# EAGLE design schematic (EAGLE 8.5.0)
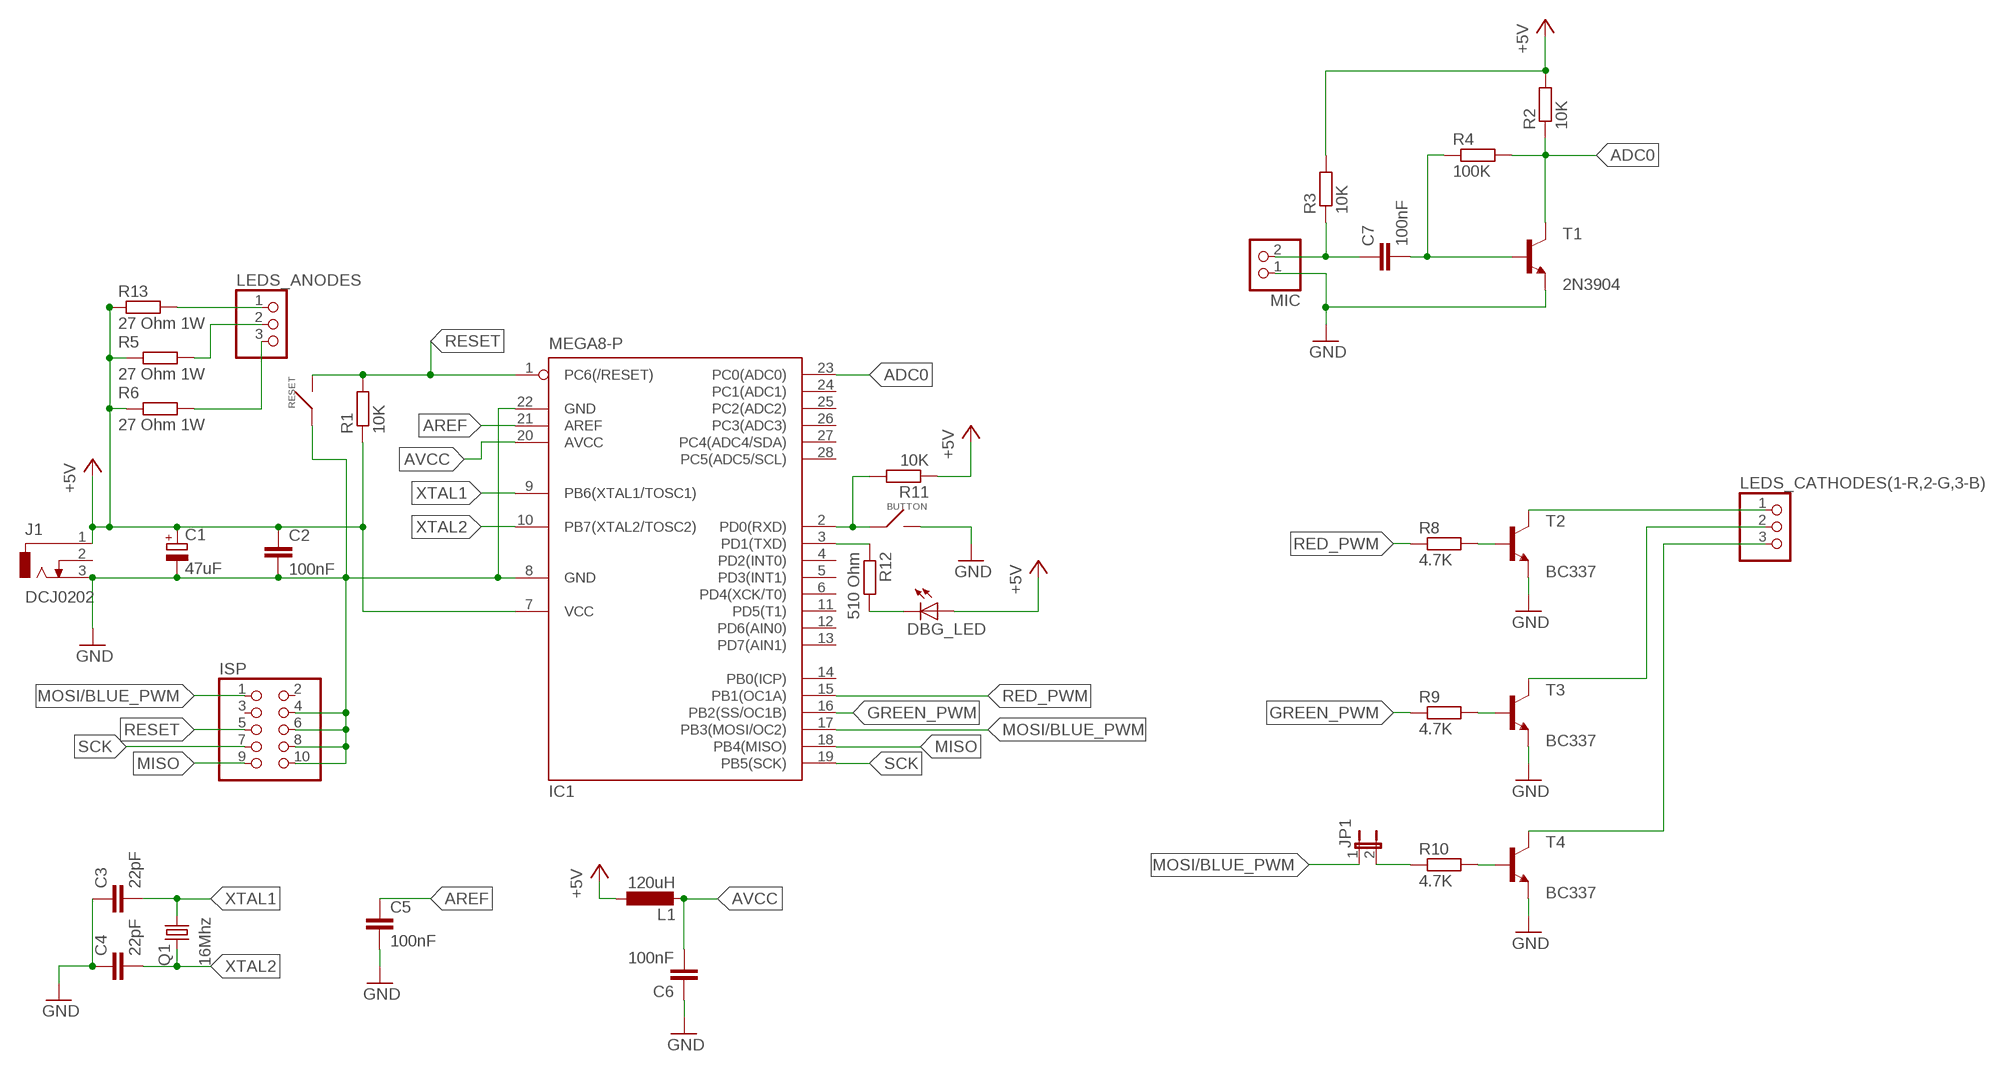
[diagram p0: schematic, sheet 1]

## Parts
BUTTON  TS1102  [TL1105]
C1  47uF  CPOL-EUE2-4  [E2-4]
C2  100nF  C-EUC1206  [C1206]
C3  22pF  C-EU050-024X044  [C050-024X044]
C4  22pF  C-EU050-024X044  [C050-024X044]
C5  100nF  C-EUC1206  [C1206]
C6  100nF  C-EUC1206  [C1206]
C7  100nF  C-EUC1206  [C1206]
DBG_LED  LED3MM  [LED3MM]
IC1  MEGA8-P  [DIL28-3]
ISP  PINHD-2X5  [2X05]
J1  DCJ0202  [DCJ0202]
JP1  JP1E  [JP1]
L1  120uH  L-EU2200-15.24  [2200-15.24]
LEDS_ANODES  PINHD-1X3  [1X03]
LEDS_CATHODES(1-R,2-G,3-B)  PINHD-1X3  [1X03]
MIC  PINHD-1X2  [1X02]
Q1  16Mhz  CRYSTALHC49S  [HC49/S]
R1  10K  R-EU_M1206  [M1206]
R2  10K  R-EU_M1206  [M1206]
R3  10K  R-EU_M1206  [M1206]
R4  100K  R-EU_M0805  [M0805]
R5  27 Ohm 1W  R-EU_0207/12  [0207/12]
R6  27 Ohm 1W  R-EU_0207/12  [0207/12]
R8  4.7K  R-EU_M0805  [M0805]
R9  4.7K  R-EU_M0805  [M0805]
R10  4.7K  R-EU_M0805  [M0805]
R11  10K  R-EU_M1206  [M1206]
R12  510 Ohm  R-EU_M1206  [M1206]
R13  27 Ohm 1W  R-EU_0207/12  [0207/12]
RESET  TS1102  [TL1105]
T1  2N3904  [TO92]
T2  BC337  [TO92]
T3  BC337  [TO92]
T4  BC337  [TO92]

## Nets
+5V: C1.+ C2.1 DBG_LED.A IC1.7(VCC) J1.1 L1.1 R1.1 R2.2 R3.2 R5.1 R6.1 R11.1 R13.1
ADC0: IC1.23(PC0(ADC0)) R2.1 R4.2 T1.1(C)
AREF: C5.1 IC1.21(AREF)
AVCC: C6.2 IC1.20(AVCC) L1.2
GND: BUTTON.2 C1.- C2.2 C3.1 C4.1 C5.2 C6.1 IC1.8(GND) IC1.22(GND) ISP.4 ISP.6 ISP.8 ISP.10 J1.3 MIC.1 RESET.1 T1.3(E) T2.1(E) T3.1(E) T4.1(E)
GREEN_PWM: IC1.16(PB2(SS/OC1B)) R9.1
MISO: IC1.18(PB4(MISO)) ISP.9
MOSI/BLUE_PWM: IC1.17(PB3(MOSI/OC2)) ISP.1 JP1.1
N$1: C7.1 MIC.2 R3.1
N$2: C7.2 R4.1 T1.2(B)
N$3: LEDS_CATHODES(1-R,2-G,3-B).1 T2.3(C)
N$4: LEDS_ANODES.1 R13.2
N$5: LEDS_ANODES.2 R5.2
N$6: LEDS_ANODES.3 R6.2
N$7: LEDS_CATHODES(1-R,2-G,3-B).2 T3.3(C)
N$8: LEDS_CATHODES(1-R,2-G,3-B).3 T4.3(C)
N$9: R8.2 T2.2(B)
N$10: R9.2 T3.2(B)
N$11: R10.2 T4.2(B)
N$12: JP1.2 R10.1
N$13: BUTTON.1 IC1.2(PD0(RXD)) R11.2
N$14: IC1.3(PD1(TXD)) R12.1
N$15: DBG_LED.K(C) R12.2
RED_PWM: IC1.15(PB1(OC1A)) R8.1
RESET: IC1.1(PC6(/RESET)) ISP.5 R1.2 RESET.2
SCK: IC1.19(PB5(SCK)) ISP.7
XTAL1: C3.2 IC1.9(PB6(XTAL1/TOSC1)) Q1.2
XTAL2: C4.2 IC1.10(PB7(XTAL2/TOSC2)) Q1.1
Unconnected: IC1.4(PD2(INT0)) IC1.5(PD3(INT1)) IC1.6(PD4(XCK/T0)) IC1.11(PD5(T1)) IC1.12(PD6(AIN0)) IC1.13(PD7(AIN1)) IC1.14(PB0(ICP)) IC1.24(PC1(ADC1)) IC1.25(PC2(ADC2)) IC1.26(PC3(ADC3)) IC1.27(PC4(ADC4/SDA)) IC1.28(PC5(ADC5/SCL)) ISP.2 ISP.3 J1.2

## Library data of the parts
BUTTON RESET = untitled:TS1102
C1 = rcl:CPOL-EU: POLARIZED CAPACITOR, European symbol
C2-C7 = rcl:C-EU: CAPACITOR, European symbol
DBG_LED = led:LED: LED OSRAM: - CHIPLED LG R971, LG N971, LY N971, LG Q971, LY Q971, LO R971, LY R971 LH N974, LH R974 LS Q976, LO Q976, LY Q976 LO Q996 - Hyper CHIPLED LW Q18S LB Q993, LB Q99A, LB R99A - SideLED LS A670, LO A670, LY A670, LG A670, LP A670 LB A673, LV A673, LT A673, LW A673 LH A674 LY A675 LS A676, LA A676, LO A676, LY A676, LW A676 LS A679, LY A679, LG A679 - Hyper Micro SIDELED® LS Y876, LA Y876, LO Y876, LY Y876 LT Y87S - SmartLED LW L88C, LW L88S LB L89C, LB L89S, LG L890 LS L89K, LO L89K, LY L89K LS L896, LA L896, LO L896, LY L896 - TOPLED LS T670, LO T670, LY T670, LG T670, LP T670 LSG T670, LSP T670, LSY T670, LOP T670, LYG T670 LG T671, LOG T671, LSG T671 LB T673, LV T673, LT T673, LW T673 LH T674 LS T676, LA T676, LO T676, LY T676, LB T676, LH T676, LSB T676, LW T676 LB T67C, LV T67C, LT T67C, LS T67K, LO T67K, LY T67K, LW E67C LS E67B, LA E67B, LO E67B, LY E67B, LB E67C, LV E67C, LT E67C LW T67C LS T679, LY T679, LG T679 LS T770, LO T770, LY T770, LG T770, LP T770 LB T773, LV T773, LT T773, LW T773 LH T774 LS E675, LA E675, LY E675, LS T675 LS T776, LA T776, LO T776, LY T776, LB T776 LHGB T686 LT T68C, LB T68C - Hyper Mini TOPLED® LB M676 - Mini TOPLED Santana® LG M470 LS M47K, LO M47K, LY M47K Source: http://www.osram.convergy.de LUXEON: - LUMILED® LXK2-PW12-R00, LXK2-PW12-S00, LXK2-PW14-U00, LXK2-PW14-V00 LXK2-PM12-R00, LXK2-PM12-S00, LXK2-PM14-U00 LXK2-PE12-Q00, LXK2-PE12-R00, LXK2-PE12-S00, LXK2-PE14-T00, LXK2-PE14-U00 LXK2-PB12-K00, LXK2-PB12-L00, LXK2-PB12-M00, LXK2-PB14-N00, LXK2-PB14-P00, LXK2-PB14-Q00 LXK2-PR12-L00, LXK2-PR12-M00, LXK2-PR14-Q00, LXK2-PR14-R00 LXK2-PD12-Q00, LXK2-PD12-R00, LXK2-PD12-S00 LXK2-PH12-R00, LXK2-PH12-S00 LXK2-PL12-P00, LXK2-PL12-Q00, LXK2-PL12-R00 Source: www.luxeon.com KINGBRIGHT: KA-3528ASYC Source: www.kingbright.com
IC1 = atmel:MEGA8-P: MICROCONTROLLER 8 Kbytes FLASH, 1 kbytes SRAM, 512 bytes EEPROM, USART, 4-channel 10 bit ADC, 2-channel 8 bit ADC Pin compatible with Atmega48, ATMega88, ATMega168 Source: avr.lbr; OC_FARNELL: unknown; OC_NEWARK: unknown
ISP = pinhead:PINHD-2X5: PIN HEADER
J1 = con-jack:DCJ0202: DC POWER JACK Source: DCJ0202.pdf; OC_FARNELL: unknown; OC_NEWARK: unknown
JP1 = jumper:JP1E: JUMPER
L1 = rcl:L-EU: INDUCTOR, European symbol
LEDS_ANODES LEDS_CATHODES(1-R,2-G,3-B) = pinhead:PINHD-1X3: PIN HEADER
MIC = pinhead:PINHD-1X2: PIN HEADER
Q1 = crystal:CRYSTAL: CRYSTAL; OC_FARNELL: 1667008; OC_NEWARK: unknown
R1-R6 R8-R13 = rcl:R-EU_: RESISTOR, European symbol
T1 = transistor:2N3904: NPN TRANSISTOR
T2-T4 = transistor:BC337: NPN TRANSISTOR

## Board
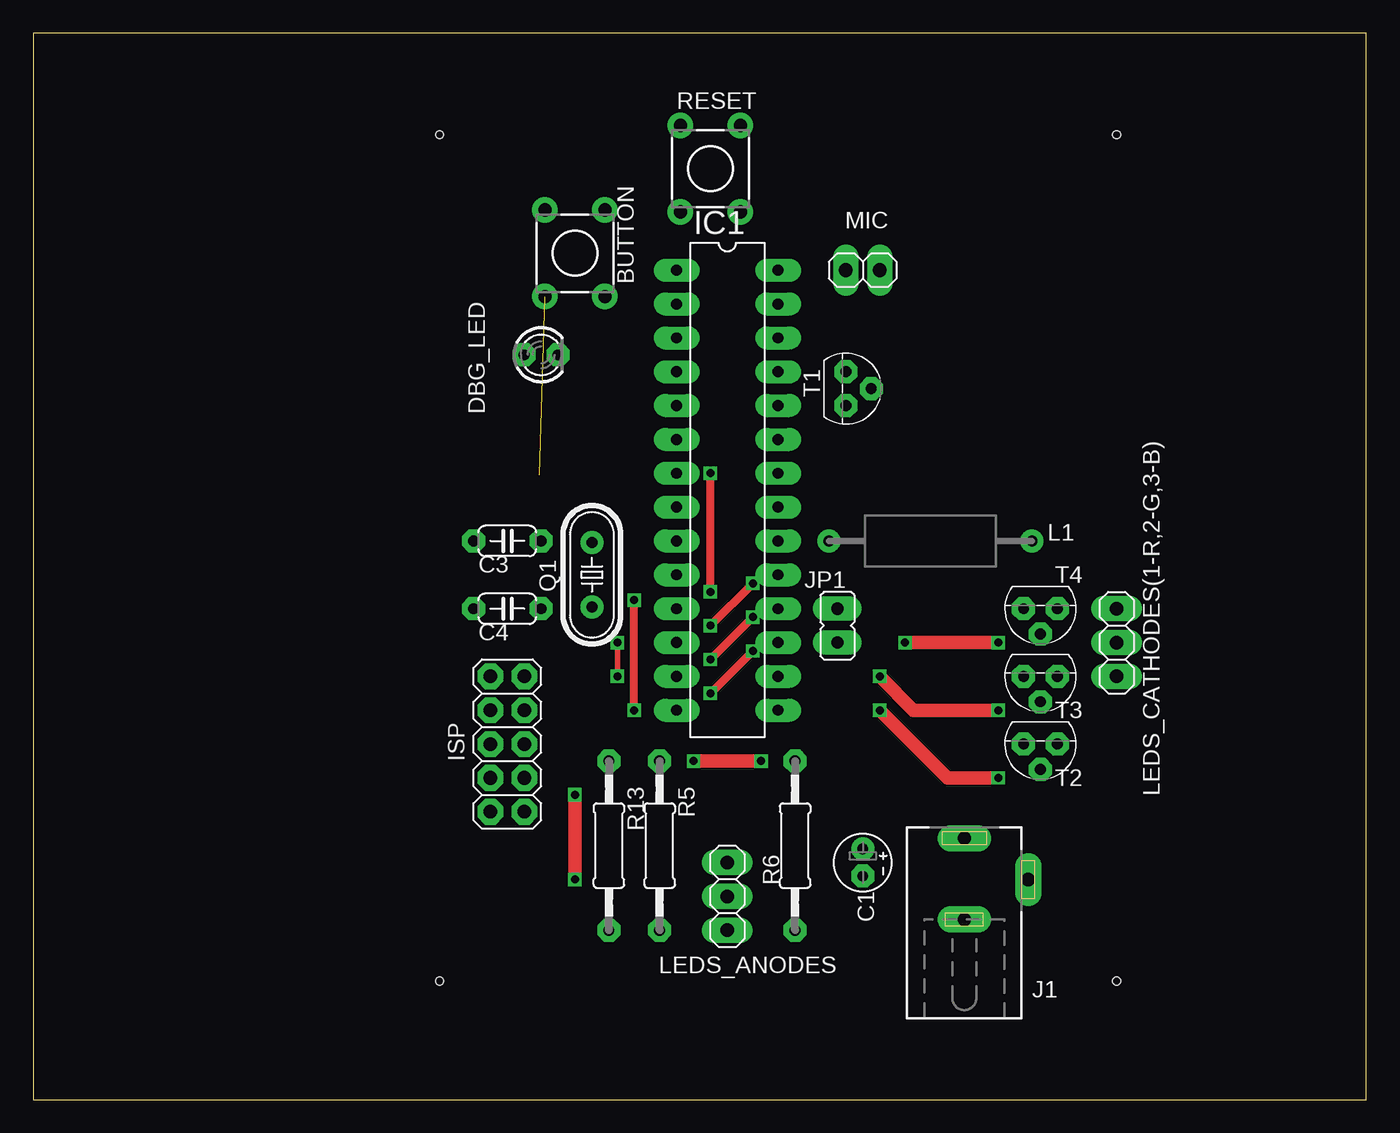
[diagram p1: board, top side]
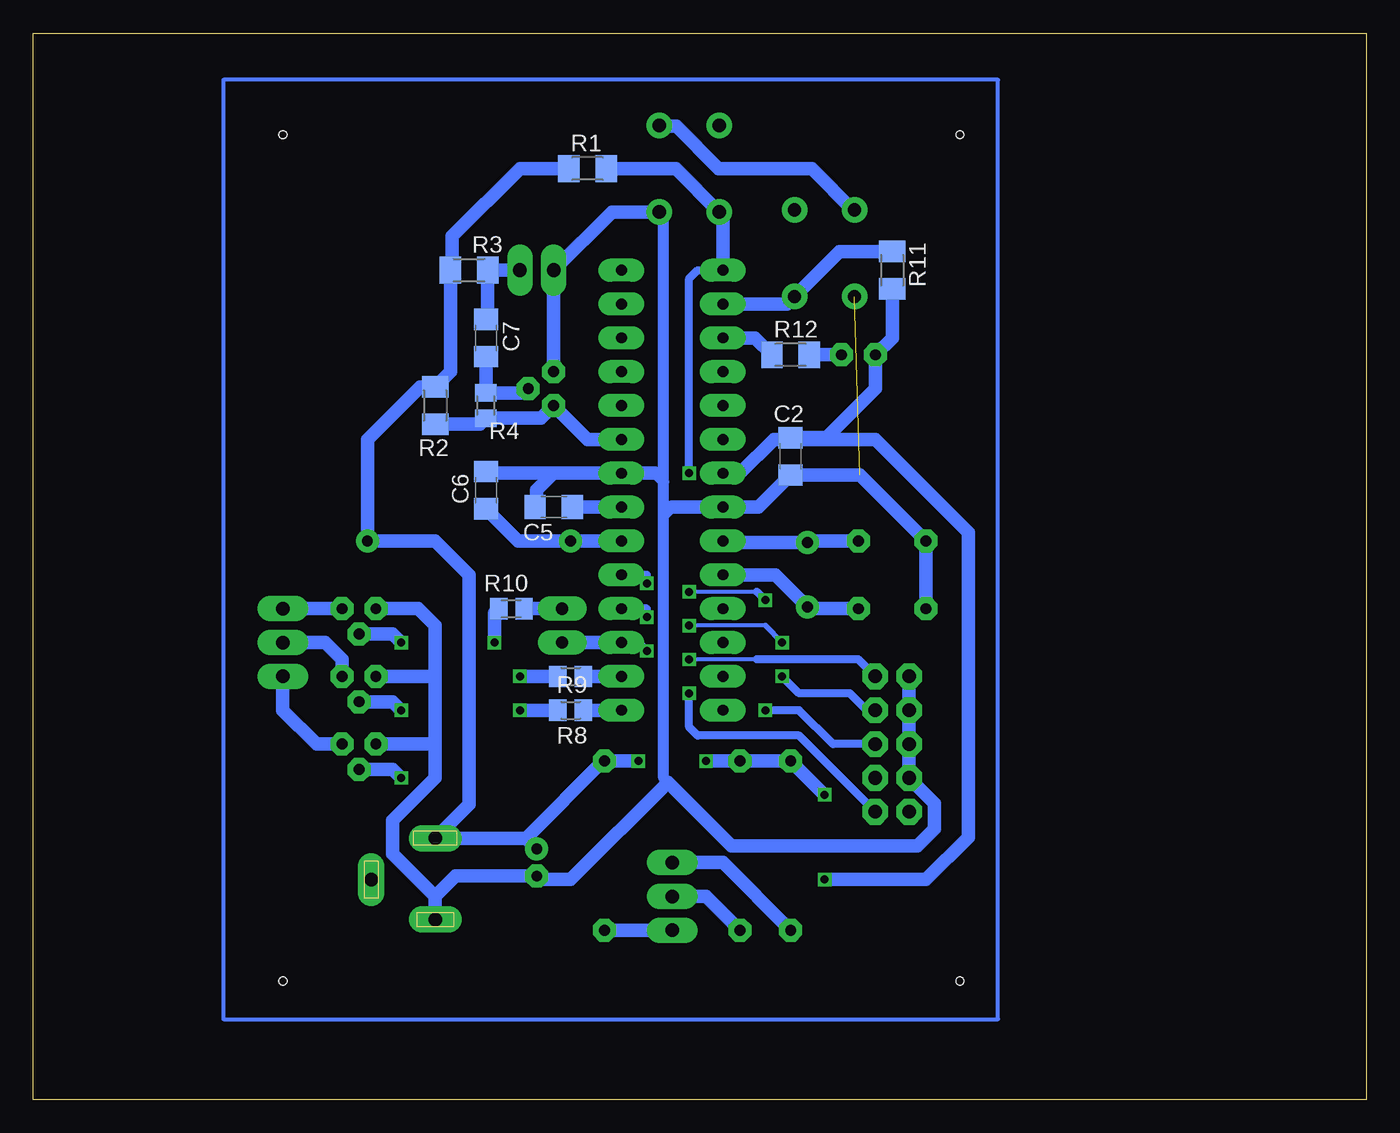
[diagram p2: board, bottom side, seen from below]

Size 100 x 80 mm. Coordinates in mm from the lower left corner, seen from the top.
Outline: 0,0 100,0 100,80 0,80 0,0
Copper layers (1*16): Top 0.035mm / dielectric 1.5mm / Bottom 0.035mm
Design rules "default *": minimum track width 10mil, minimum drill 20mil, track to track 12mil, track to pad 8mil, pad to pad 12mil, via to via 12mil, smd to smd 8mil, copper to edge 32mil, drill to drill 40mil, minimum pad ring 18mil, minimum via ring 8mil, stop-mask expansion 4mil, vias tented up to drill 0mil, thermal gap 10mil
Holes 0.6 mm at 30.48,8.89 81.28,8.89 81.28,72.39 30.48,72.39

### Footprints (pad centres in the part's own frame; a part is rotated, then mirrored left to right if it is on the bottom)
TL1105 = drill 1 pad 1.676: 1 -2.25,3.25; 2 2.25,3.25; 3 -2.25,-3.25; 4 2.25,-3.25
E2-4 = drill 0.813 pad 1.27: + -1.016,0 | drill 0.813 pad 1.27 octagon: - 1.016,0
C1206 = smd 1.6 x 1.8: 1 -1.4,0; 2 1.4,0
C050-024X044 = drill 0.813 octagon: 1 -2.54,0; 2 2.54,0
LED3MM = drill 0.813 octagon: A -1.27,0; K 1.27,0
DIL28-3 = drill 0.813 long: 1 -16.51,-3.81; 2 -13.97,-3.81; 3 -11.43,-3.81; 4 -8.89,-3.81; 5 -6.35,-3.81; 6 -3.81,-3.81; 7 -1.27,-3.81; 8 1.27,-3.81; 9 3.81,-3.81; 10 6.35,-3.81; 11 8.89,-3.81; 12 11.43,-3.81; 13 13.97,-3.81; 14 16.51,-3.81; 15 16.51,3.81; 16 13.97,3.81; 17 11.43,3.81; 18 8.89,3.81; 19 6.35,3.81; 20 3.81,3.81; 21 1.27,3.81; 22 -1.27,3.81; 23 -3.81,3.81; 24 -6.35,3.81; 25 -8.89,3.81; 26 -11.43,3.81; 27 -13.97,3.81; 28 -16.51,3.81
2X05 = drill 1.016 octagon: 1 -5.08,-1.27; 2 -5.08,1.27; 3 -2.54,-1.27; 4 -2.54,1.27; 5 0,-1.27; 6 0,1.27; 7 2.54,-1.27; 8 2.54,1.27; 9 5.08,-1.27; 10 5.08,1.27
DCJ0202 = drill 1 pad 2 long: 1 0,3.1; 2 4.8,0; 3 0,-3
JP1 = drill 0.914 long: 1 0,-1.27; 2 0,1.27
2200-15.24 = drill 0.8 pad 1.27: 1 -7.62,0; 2 7.62,0
1X03 = drill 1.016 long: 1 -2.54,0; 2 0,0; 3 2.54,0
1X02 = drill 1.016 long: 1 -1.27,0; 2 1.27,0
HC49/S = drill 0.813: 1 -2.413,0; 2 2.413,0
M1206 = smd 1.6 x 2: 1 -1.4,0; 2 1.4,0
M0805 = smd 1.3 x 1.6: 1 -0.95,0; 2 0.95,0
0207/12 = drill 0.813 octagon: 1 -6.35,0; 2 6.35,0
TO92 = drill 0.813 octagon: 1 1.27,0; 2 0,1.905; 3 -1.27,0

### Placement (x,y rotation side)
BUTTON  40.64,63.5 180 top
C1  62.23,17.78 270 top
C2  43.18,48.26 270 bottom
C3  35.56,41.91 0 top
C4  35.56,36.83 0 top
C5  60.96,44.45 180 bottom
C6  66.04,45.72 270 bottom
C7  66.04,57.15 270 bottom
DBG_LED  38.1,55.88 0 top
IC1  52.07,45.72 270 top
ISP  35.56,26.67 90 top
J1  69.85,16.51 0 top
JP1  60.33,35.56 0 top
L1  67.31,41.91 180 top
LEDS_ANODES  52.07,15.24 270 top
LEDS_CATHODES(1-R,2-G,3-B)  81.28,34.29 90 top
MIC  62.23,62.23 0 top
Q1  41.91,39.37 90 top
R1  58.42,69.85 0 bottom
R2  69.85,52.07 90 bottom
R3  67.31,62.23 180 bottom
R4  66.04,52.07 270 bottom
R5  46.99,19.05 270 top
R6  57.15,19.05 270 top
R8  59.69,29.21 180 bottom
R9  59.69,31.75 180 bottom
R10  64.14,36.83 180 bottom
R11  35.56,62.23 90 bottom
R12  43.18,55.88 0 bottom
R13  43.18,19.05 270 top
RESET  50.8,69.85 180 top
T1  60.96,53.34 270 top
T2  75.56,26.67 180 top
T3  75.56,31.75 180 top
T4  75.56,36.83 180 top

### Tracks (layer width: path | path; a pad name or v marks a point on that pad's centre or on a via)
+5V  (via drill 0.6)
  Top 1.016: v49.53,25.4 v54.61,25.4 | v40.64,16.51 v40.64,22.86
  Bottom 1.016: IC1.7 46.99,46.99 44.45,49.53 43.31,49.53 C2.1 | R1.1 63.5,69.85 68.58,64.77 68.58,62.36 R3.2 68.71,54.61 R2.2 70.99,53.47 74.93,49.53 L1.1 69.85,41.91 67.31,39.37 67.31,22.15 J1.1 63.04,19.61 | R11.1 35.56,57.15 DBG_LED.A 36.83,53.34 40.51,49.66 C2.1 | 63.04,19.61 C1.+ | 63.04,19.61 57.25,25.4 R6.1 v54.61,25.4 | v49.53,25.4 R5.1 R13.1 v40.64,22.86 | v40.64,16.51 33.02,16.51 29.84,19.68 29.84,42.55 36.83,49.53 43.05,49.53 C2.1
ADC0
  Bottom 1.016: IC1.23 58.42,49.53 T1.1 61.91,51.12 R4.2 66.49,50.67 R2.1
AREF
  Bottom 1.016: IC1.21 C5.1
AVCC
  Bottom 1.016: IC1.20 L1.2 63.63,41.91 C6.2
GND  (1 unrouted)
  Bottom 0.813: 52.7,46.35 53.34,46.99 | 52.7,46.35 52.7,66.25 RESET.1 | 52.7,43.81 52.7,24.13 52.39,23.81 | 52.7,43.81 52.7,46.35 | 52.7,43.81 52.07,44.45
  Bottom 1.016: IC1.22 60.96,46.99 62.23,45.72 62.23,44.58 C5.2 | IC1.22 65.91,46.99 C6.1 | T1.3 MIC.1 56.59,66.6 RESET.1 | C4.1 C3.1 37.97,46.86 C2.2 45.59,44.45 IC1.8 52.07,44.45 | 53.34,46.99 IC1.22 | T4.1 71.12,36.83 69.85,35.56 69.85,31.75 | 69.85,26.67 69.85,24.13 73.03,20.95 73.03,18.41 69.85,15.24 | 69.85,26.67 69.85,31.75 | 69.85,15.24 J1.3 | 69.85,31.75 T3.1 | 69.85,26.67 T2.1 | 69.85,15.24 68.33,16.76 C1.- 61.98,16.51 59.69,16.51 52.39,23.81 47.62,19.05 33.66,19.05 32.38,20.32 32.38,22.23 ISP.4 ISP.6 ISP.8 ISP.10
GREEN_PWM
  Bottom 1.016: IC1.16 R9.1
MISO  (via drill 0.6)
  Top 0.61: v50.8,33.02 v53.98,36.2
  Bottom 0.305: 45.72,33.02 v50.8,33.02
  Bottom 0.61: IC1.18 53.98,36.83 v53.98,36.2 | 45.72,33.02 38.1,33.02 ISP.9
MOSI/BLUE_PWM  (via drill 0.6)
  Top 0.61: v50.8,30.48 v53.98,33.66
  Bottom 0.61: IC1.17 54.61,34.29 v53.98,33.66 | v50.8,30.48 50.8,27.94 50.16,27.3 42.55,27.3 ISP.1
  Bottom 1.016: IC1.17 JP1.1
N$1
  Bottom 1.016: C7.1 65.91,58.68 R3.1 MIC.2
N$2
  Bottom 1.016: T1.2 63.19,53.02 R4.1 C7.2
N$3
  Bottom 1.016: T2.3 78.74,26.67 81.28,29.21 LEDS_CATHODES(1-R,2-G,3-B).1
N$4
  Bottom 1.016: R13.2 48.26,17.78 LEDS_ANODES.1
N$5
  Bottom 1.016: R5.2 49.53,15.24 LEDS_ANODES.2
N$6
  Bottom 1.016: LEDS_ANODES.3 R6.2
N$7
  Bottom 1.016: T3.3 76.83,33.02 78.11,34.29 LEDS_CATHODES(1-R,2-G,3-B).2
N$8
  Bottom 1.016: T4.3 LEDS_CATHODES(1-R,2-G,3-B).3
N$9  (via drill 0.6)
  Top 1.016: v72.39,24.13 68.58,24.13 v63.5,29.21
  Bottom 1.016: T2.2 73.03,24.77 v72.39,24.13 | R8.2 v63.5,29.21
N$10  (via drill 0.6)
  Top 1.016: v72.39,29.21 66.04,29.21 v63.5,31.75
  Bottom 1.016: T3.2 73.03,29.84 v72.39,29.21 | R9.2 v63.5,31.75
N$11  (via drill 0.6)
  Top 1.016: v65.41,34.29 v72.39,34.29
  Bottom 1.016: T4.2 73.03,34.92 v72.39,34.29 | v65.41,34.29 65.41,36.51 R10.2
N$12
  Bottom 1.016: JP1.2 R10.1
N$13
  Bottom 1.016: IC1.2 43.45,59.69 BUTTON.1 39.51,63.63 R11.2
N$14
  Bottom 1.016: IC1.3 45.85,57.15 R12.1
N$15
  Bottom 1.016: DBG_LED.K R12.2
N$17
  Bottom 1.016: 38.42,66.67 41.59,69.85 48.58,69.85 51.75,73.03 53.02,73.03
N$18
  Bottom 0.305: 85.72,6.03 27.62,6.03 27.62,76.52 85.72,76.52 85.72,6.03
RED_PWM
  Bottom 1.016: IC1.15 R8.1
RESET  (via drill 0.6)
  Top 0.61: v50.8,38.1 v50.8,46.99 | v45.09,29.21 v45.09,37.47
  Bottom 0.305: 45.72,38.1 v50.8,38.1
  Bottom 0.61: IC1.1 50.16,62.23 50.8,61.59 v50.8,46.99 | v45.09,37.47 45.72,38.1 | v45.09,29.21 42.55,29.21 40.01,26.67 ISP.5
  Bottom 1.016: IC1.1 48.26,66.31 RESET.2 51.8,69.85 R1.2
SCK  (via drill 0.6)
  Top 0.406: v43.81,31.75 v43.81,34.29
  Top 0.61: v50.8,35.56 v53.98,38.73
  Bottom 0.305: 45.09,35.56 v50.8,35.56
  Bottom 0.406: v43.81,34.29 45.09,35.56
  Bottom 0.61: IC1.19 53.98,39.37 v53.98,38.73 | v43.81,31.75 42.55,30.48 38.73,30.48 37.47,29.21 ISP.7
XTAL1
  Bottom 1.016: IC1.9 48.26,41.78 Q1.2 41.78,41.91 C3.2
XTAL2
  Bottom 1.016: IC1.10 44.32,39.37 Q1.1 41.78,36.83 C4.2